# Altium schematic sheet Sheet1.SchDoc
size A; SheetNumber: 1; SheetTotal: 1
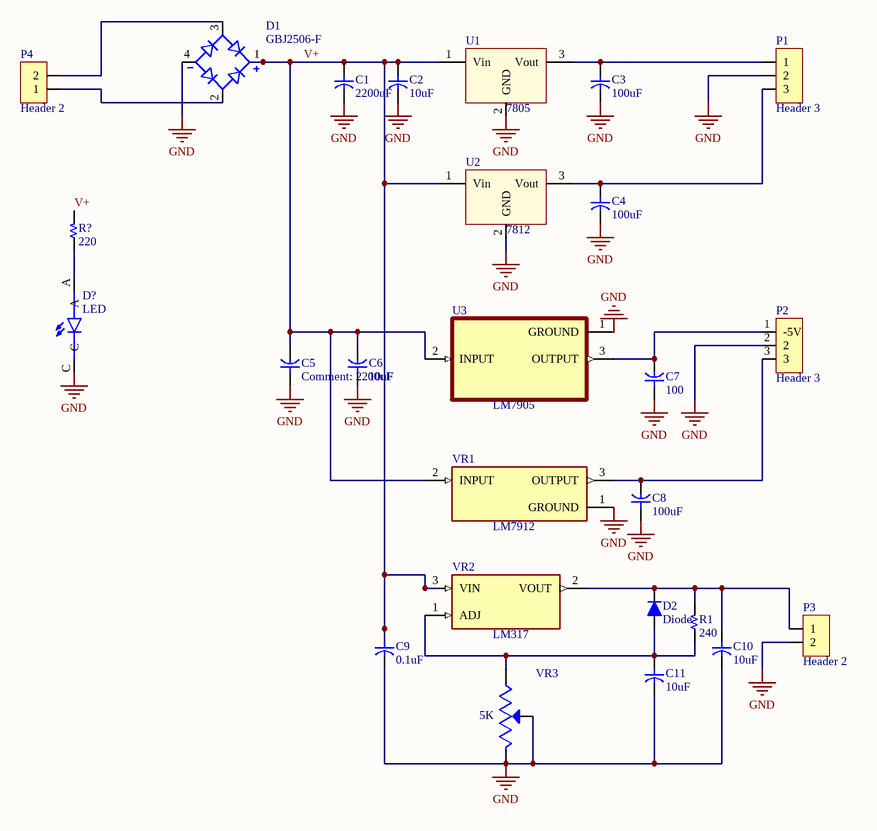
[diagram p0: Sheet1.SchDoc]

## Parts
C1  2200uF  [CYL/D.400/LS.200]
C2  10uF  [CYL/D.400/LS.200]
C3  100uF  [CYL/D.400/LS.200]
C4  100uF  [CYL/D.400/LS.200]
C5  2200uF  [CYL/D.400/LS.200]
C6  10uF  [CYL/D.400/LS.200]
C7  100  [CYL/D.400/LS.200]
C8  100uF  [CYL/D.400/LS.200]
C9  0.1uF  [CYL/D.400/LS.200]
C10  10uF  [CYL/D.400/LS.200]
C11  10uF  [CYL/D.400/LS.200]
D1  GBJ2506-F  [DIOB_GBJ2506-F]
D2  Diode  [DO-41]
D?  LED  [LED_WP7113ID]
P1  Header 3  [HDR/Terminal/3]
P2  Header 3  [HDR/Terminal/3]
P3  Header 2  [HDR/Terminal/2]
P4  Header 2  [HDR/Terminal/2]
R1  240  [R 1/4W/300]
R?  220  [R 1/4W/300]
U1  7805  [TO-220]
U2  7812  [TO-220]
U3  LM7905  [TO254P1054X470X1955-3]
VR1  LM7912  [TO254P1054X470X1955-3]
VR2  LM317  [TO254P1054X470X1955-3]
VR3  5K  [TRIM_3296W-1-250]

## Nets
GND: C1.2 C2.2 C3.2 C4.2 C5.1 C6.1 C7.1 C8.1 C9.2 C10.2 C11.2 D1.4(NEG) D?.C P1.2 P2.2 P3.2 U1.2(GND) U2.2(GND) U3.1(GROUND) VR1.1(GROUND) VR3.2(WIPER) VR3.3(CW)
V+: C1.1 C2.1 C5.2 C6.2 C9.1 D1.1(POS) R?.2 U1.1(Vin) U2.1(Vin) U3.2(INPUT) VR1.2(INPUT) VR2.3(VIN)
NetC3_1: C3.1 P1.1 U1.3(Vout)
NetC4_1: C4.1 P1.3 U2.3(Vout)
NetC7_2: C7.2 P2.1(-5V) U3.3(OUTPUT)
NetC8_2: C8.2 P2.3 VR1.3(OUTPUT)
NetC10_1: C10.1 D2.2(K) P3.1 R1.2 VR2.2(VOUT)
NetC11_1: C11.1 D2.1(A) R1.1 VR2.1(ADJ) VR3.1(CCW)
NetD1_2: D1.2(AC1) P4.1
NetD1_3: D1.3(AC2) P4.2
NetD?_A: D?.A R?.1

## Library data of the parts
C1-C11 = Capacitor: Capacitor pol
D1 = GBJ2506-F: Bridge Rectifier Single Phase Standard 600 V Through Hole GBJ; MF: Diodes Inc.; SnapEDA_Link: https://www.snapeda.com/parts/GBJ2506-F/Diodes+Inc./view-part/?ref=snap; Purchase-URL: https://pricing.snapeda.com/search/part/GBJ2506-F/?ref=eda; Value: *; MP: GBJ2506-F; Availability: In Stock; Check_prices: https://www.snapeda.com/parts/GBJ2506-F/Diodes+Inc./view-part/?ref=eda; Package: SIP-4 Diodes Incorporated; Price: None
D2 = Diode: Default Diode
D? = WP7113ID: Red 617nm LED Indication - Discrete 2V Radial; MF: Kingbright; Price: None; MP: WP7113ID; Package: Radial Kingbright; Check_prices: https://www.snapeda.com/parts/WP7113ID/Kingbright/view-part/?ref=eda; Purchase-URL: https://pricing.snapeda.com/search/part/WP7113ID/?ref=eda; Availability: In Stock; Value: *; SnapEDA_Link: https://www.snapeda.com/parts/WP7113ID/Kingbright/view-part/?ref=snap
P1 P2 = Header 3: Header, 3-Pin
P3 P4 = Header 2: Header, 2-Pin
R1 R? = Resistor
U1 U2 = 78xx: LDO Fixed Voltage regulator
  U1: ComponentLink1Description: New link; ComponentLink1URL: *
U3 = LM7905CT: 1.5-A, negative linear voltage regulator 3-TO-220 0 to 125; MF: Texas Instruments; SnapEDA_Link: https://www.snapeda.com/parts/LM7905CT/Texas+Instruments/view-part/?ref=snap; Package: TO-220-3 Texas Instruments; Value: *; MP: LM7905CT; Check_prices: https://www.snapeda.com/parts/LM7905CT/Texas+Instruments/view-part/?ref=eda
VR1 = LM7912CT/NOPB: 1.5-A, regulador de voltaje lineal negativo; MF: Texas Instruments; SnapEDA_Link: https://www.snapeda.com/parts/LM7912CT/NOPB/Texas+Instruments/view-part/?ref=snap; Package: TO-220-3 Texas Instruments; Value: *; MP: LM7912CT/NOPB; Check_prices: https://www.snapeda.com/parts/LM7912CT/NOPB/Texas+Instruments/view-part/?ref=eda
VR2 = LM317T: Linear Voltage Regulator IC Positive Adjustable 1 Output 1.5A TO-220-3; MF: ON Semiconductor; SnapEDA_Link: https://www.snapeda.com/parts/LM317T/Onsemi/view-part/?ref=snap; Package: TO-220-3 ON; Value: *; MP: LM317T; Check_prices: https://www.snapeda.com/parts/LM317T/Onsemi/view-part/?ref=eda
VR3 = 3296W-1-250: 25 Ohms 0.5W, 1/2W PC Pins Through Hole Trimmer Potentiometer Cermet 25.0 Turn Top Adjustment; MF: Bourns; Purchase-URL: https://pricing.snapeda.com/search/part/3296W-1-250/?ref=eda; Check_prices: https://www.snapeda.com/parts/3296W-1-250/Bourns/view-part/?ref=eda; SnapEDA_Link: https://www.snapeda.com/parts/3296W-1-250/Bourns/view-part/?ref=snap; Price: None; Availability: In Stock; Package: NON STANDARD-3 Bourns; MP: 3296W-1-250; Value: *